# Altium schematic sheet LoadCellAmp1.SchDoc
size A4; SheetNumber: 9; SheetTotal: 11
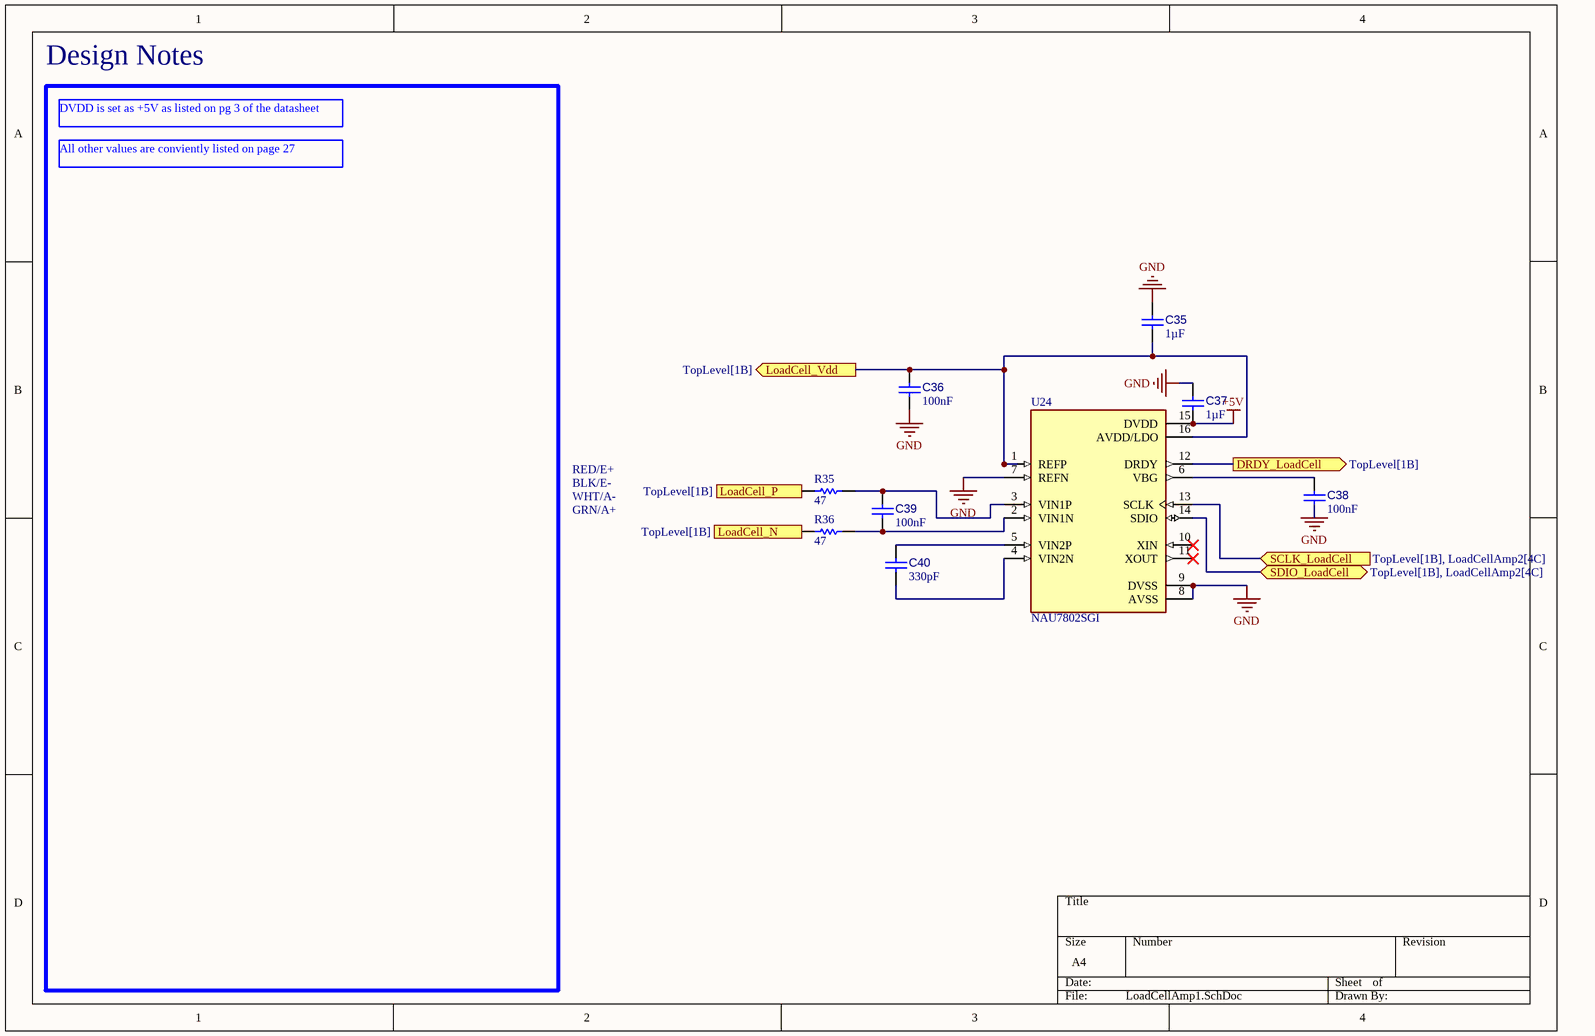
[diagram p0: LoadCellAmp1.SchDoc]

## Parts
C35  value 1µF  [CAPC2013X135X45ML10T25]  (hidden comment: Capacitor 1 uF +/- 10% 50 V 0805)
C36  value 100nF  [CAPC1608X90X40NL10T20]  (hidden comment: Capacitor 100 nF +/-10% 50 V 0603)
C37  value 1µF  [CAPC2013X135X45ML10T25]  (hidden comment: Capacitor 1 uF +/- 10% 50 V 0805)
C38  value 100nF  [CAPC1608X90X40NL10T20]  (hidden comment: Capacitor 100 nF +/-10% 50 V 0603)
C39  value 100nF  [CAPC1608X90X40NL10T20]  (hidden comment: Capacitor 100 nF +/-10% 50 V 0603)
C40  value 330pF  [CAP_0603]  (hidden comment: CAP CER 330pF 50V 1% 0603)
R35  value 47  [RESC1608X50X30ML20T20]  (hidden comment: RG1608N-470-W-T1)
R36  value 47  [RESC1608X50X30ML20T20]  (hidden comment: RG1608N-470-W-T1)
U24  NAU7802SGI  [NAU7802SGI-Footprint-1]

## Ports
DRDY_LoadCell (out, see TopLevel[1B]), LoadCell_N (in, see TopLevel[1B]), LoadCell_P (in, see TopLevel[1B]), LoadCell_Vdd (out, see TopLevel[1B]), SCLK_LoadCell (in, see TopLevel[1B], LoadCellAmp2[4C]), SDIO_LoadCell (bidir, see TopLevel[1B], LoadCellAmp2[4C])

## Nets
+5V: C37.1 U24.15(DVDD)
GND: C35.2 C36.1 C37.2 C38.1 U24.7(REFN) U24.8(AVSS) U24.9(DVSS)
DRDY_LoadCell: U24.12(DRDY) ; port DRDY_LoadCell
LoadCell_N: R36.1 ; port LoadCell_N
LoadCell_P: R35.1 ; port LoadCell_P
LoadCell_Vdd: C35.1 C36.2 U24.1(REFP) U24.16(AVDD/LDO) ; port LoadCell_Vdd
SCLK_LoadCell: U24.13(SCLK) ; port SCLK_LoadCell
SDIO_LoadCell: U24.14(SDIO) ; port SDIO_LoadCell
NetC38_2: C38.2 U24.6(VBG)
NetC39_1: C39.1 R36.2 U24.2(VIN1N)
NetC39_2: C39.2 R35.2 U24.3(VIN1P)
NetC40_1: C40.1 U24.4(VIN2N)
NetC40_2: C40.2 U24.5(VIN2P)

Not connected (* = marked no-connect by the designer): U24 10(XIN)* 11(XOUT)*

## Notes on the sheet
- Design Notes
- DVDD is set as +5V as listed on pg 3 of the datasheet
- All other values are conviently listed on page 27
- GRN/A+
- WHT/A-
- BLK/E-
- RED/E+

## Library data of the parts
C35 C37 = CMP-001-00007-7: Chip Capacitor, 1 uF, +/- 10%, 50 V, 0805 (2012 Metric); Voltage Rating: 50V; Capacitor Type: Ceramic; Pins: 2; RoHS Compliant: True; Case/Package: 0805; Min Operating Temperature: -55°C; Max Operating Temperature: 125°C; Mounting Technology: SM; Tolerance: 10%
C36 C38 C39 = CMP-001-00017-7: Chip Capacitor, 100 nF, +/- 10%, 50 V, 0603 (1608 Metric); Voltage Rating: 50V; Capacitor Type: Ceramic; Mounting Technology: SM; Case/Package: 0603; Tolerance: 10%; Max Operating Temperature: 125°C; Min Operating Temperature: -55°C; Pins: 2; RoHS Compliant: True
C40 = CMP-001-00107-2: KGM15ACG1H331FT - Cap Ceramic 330pF 50V C0G 1% Pad SMD 0603 125C T/R; Pins: 2; Case/Package: 0603; Capacitor Type: Ceramic; Mounting Technology: Surface Mount; Min Operating Temperature: -55°C; Max Operating Temperature: 125°C; RoHS Compliant: Yes
R35 R36 = CMP-009-00323-1: Fixed Resistor, Metal Film, 0.1W, 47ohm, 75V, 0.05% +/-Tol, 10ppm/Cel, Surface Mount, 0603; Power: 100mW; Max Operating Temperature: 155°C; Pins: 2; Tolerance: 0.05%; Case/Package: 0603; Min Operating Temperature: -55°C; RoHS Compliant: Yes; Mounting Technology: Surface Mount
U24 = CMP-014-00002-1: ADC, Delta-Sigma, 24-Bit, 1 Func, 2 Channel, Serial Access, PDSO16